# Altium schematic sheet [08] - Slave_Power.SchDoc: =ProjectName
size A4; CheckedBy: DatNB; Author: Ven; CompanyName: Nacentech; Organization: IMET
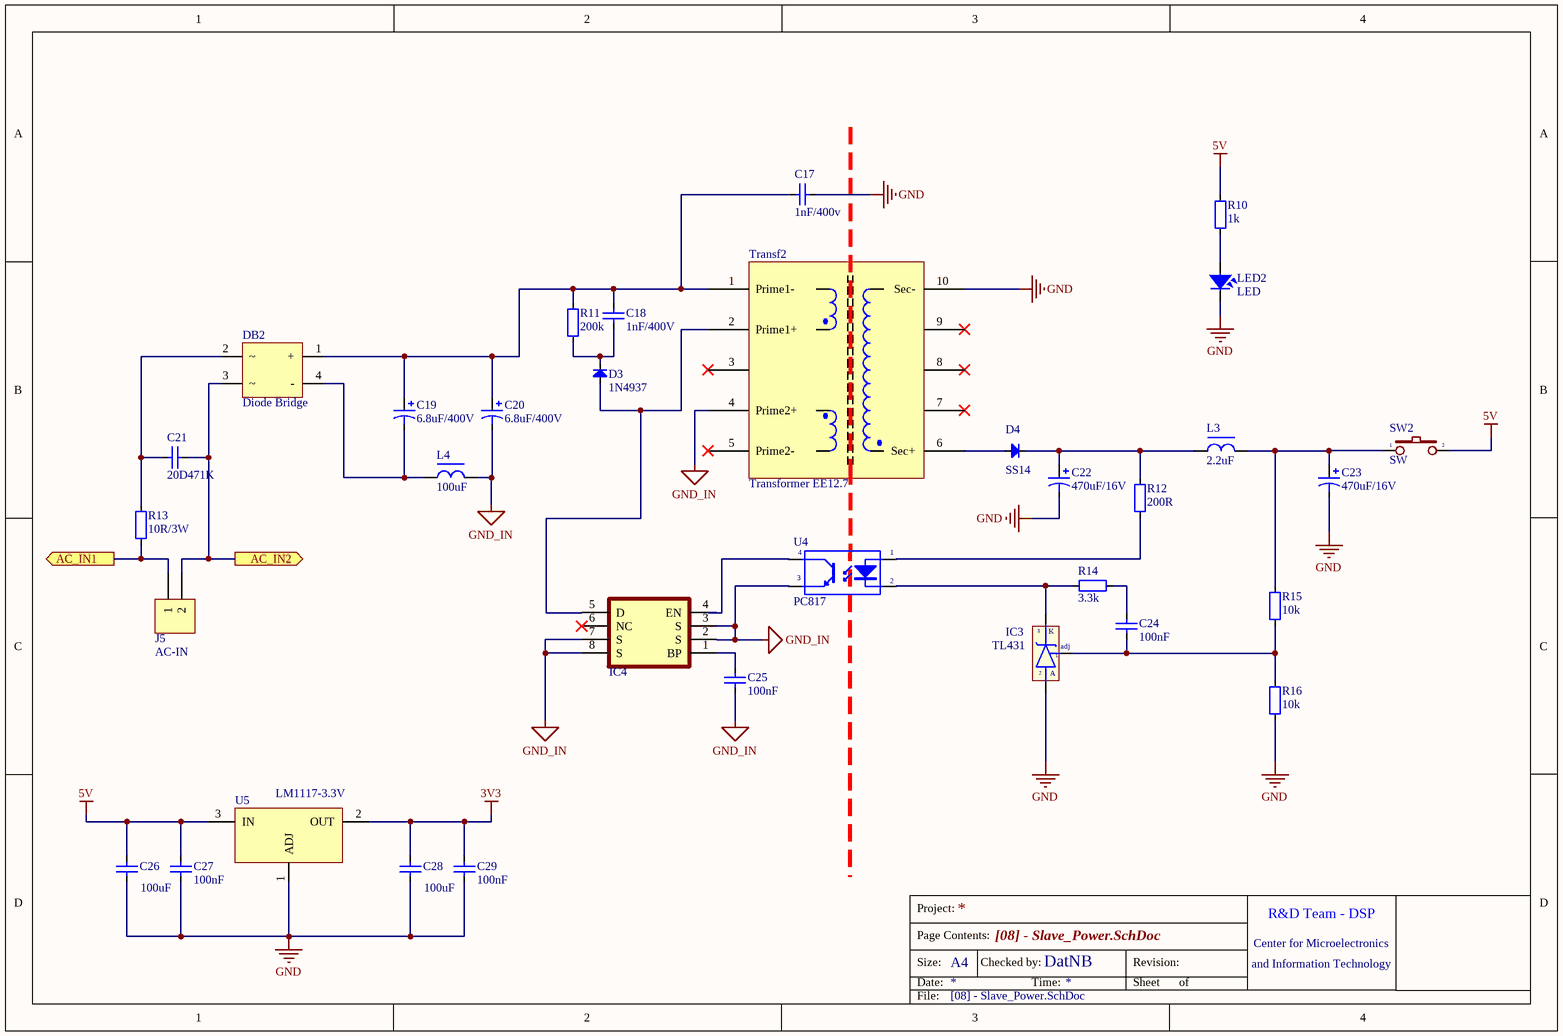
[diagram p0: [08] - Slave_Power.SchDoc]

## Parts
C17  1nF/400v  [103/2KV]
C18  1nF/400V  [103/2KV]
C19  6.8uF/400V  [C8mm]
C20  6.8uF/400V  [C8mm]
C21  20D471K  [103/2KV]
C22  470uF/16V  [C8mm]
C23  470uF/16V  [C8mm]
C24  100nF  [CAP_0805]
C25  100nF  [CAP_0805]
C26  100uF  [CAP_3216]
C27  100nF  [CAP_0805]
C28  100uF  [CAP_3216]
C29  100nF  [CAP_0805]
D3  1N4937  [DIO-1AN]
D4  SS14  [DO-214AC(SMA)]
DB2  Diode Bridge  [DB207S]
IC3  TL431  [qto-92]
IC4  TNY267  [DIP8]  (value not drawn)
J5  AC-IN  [KF2-5.08]
L3  2.2uF  [L-SMD-M-7.3x4.5]
L4  100uF  [L-DIP-M-9.5x6]
LED2  LED  [LED-0805-Red]
R10  1k  [RES-SMD-0805]
R11  200k  [RES-1/4WD]
R12  200R  [RES-SMD-0805]
R13  10R/3W  [RES-1WD]
R14  3.3k  [RES-SMD-0805]
R15  10k  [RES-SMD-0805]
R16  10k  [RES-SMD-0805]
SW2  SW  [SW2]
Transf2  Transformer EE12.7  [Transformer EE12.7]
U4  PC817  [DIP4/W0.3]
U5  LM1117-3.3V  [LM1117-SOP]

## Ports
AC_IN1 (out), AC_IN2 (out)

## Nets
3V3: C28.2 C29.2 U5.2(OUT)
5V: C26.2 C27.2 R10.2 SW2.2 U5.3(IN)
GND: C17.1 C22.2 C23.2 C26.1 C27.1 C28.1 C29.1 IC3.2(A) LED2.2 R16.2 Transf2.10(Sec-) U5.1(ADJ)
GND_IN: C20.2 C25.1 IC4.2(S) IC4.3(S) IC4.7(S) IC4.8(S) L4.2 Transf2.4(Prime2+) U4.3(E)
AC_IN1: J5.1 R13.2 ; port AC_IN1
AC_IN2: C21.1 DB2.3 J5.2 ; port AC_IN2
NetC17_2: C17.2 C18.1 C19.1 C20.1 DB2.1(+) R11.2 Transf2.1(Prime1-)
NetC18_2: C18.2 D3.2(K) R11.1
NetC19_2: C19.2 DB2.4(-) L4.1
NetC21_2: C21.2 DB2.2 R13.1
NetC22_1: C22.1 D4.2(K) L3.1 R12.1
NetC23_1: C23.1 L3.2 R15.1 SW2.1
NetC24_1: C24.1 IC3.1(adj) R15.2 R16.1
NetC24_2: C24.2 R14.2
NetC25_2: C25.2 IC4.1(BP)
NetD3_1: D3.1(A) IC4.5(D) Transf2.2(Prime1+)
NetD4_1: D4.1(A) Transf2.6(Sec+)
NetIC3_3: IC3.3(K) R14.1 U4.2(K)
NetIC4_4: IC4.4(EN) U4.4(C)
NetLED2_1: LED2.1 R10.1
NetR12_2: R12.2 U4.1(A)

Not connected (* = marked no-connect by the designer): IC4 6(NC)*; Transf2 3* 5(Prime2-)* 7* 8* 9*

## Notes on the sheet
- Project:
- R&D Team - DSP
- Page Contents:
- Size:
- Date:
- A4
- Checked by:
- Time:
- Revision:
- Sheet
- of
- Center for Microelectronics
- and Information Technology
- File:

## Library data of the parts
C17 C18 = Cap2KV: CAP CERAMIC; Published: 8-Jun-2000; LatestRevisionDate: 17-Jul-2002; LatestRevisionNote: Re-released for DXP Platform.; PackageReference: RAD-0.3; Publisher: Altium Limited
C19 C20 C22 C23 = Cap Pol: Polarized Capacitor (Axial); Published: 8-Jun-2000; LatestRevisionDate: 17-Jul-2002; LatestRevisionNote: Re-released for DXP Platform.; PackageReference: POLAR0.8; Publisher: Altium Limited
C21 = Cap2KV: Varistor; Published: 8-Jun-2000; LatestRevisionDate: 17-Jul-2002; LatestRevisionNote: Re-released for DXP Platform.; PackageReference: RAD-0.3; Publisher: Altium Limited
C24 C25 C27 C29 = CapSMD: Capacitor; Value: 33p; Published: 8-Jun-2000; LatestRevisionDate: 17-Jul-2002; LatestRevisionNote: Re-released for DXP Platform.; PackageReference: RAD-0.3; Publisher: Altium Limited
C26 C28 = CapSMD: Capacitor SMD; Value: 33p; Published: 8-Jun-2000; LatestRevisionDate: 17-Jul-2002; LatestRevisionNote: Re-released for DXP Platform.; PackageReference: RAD-0.3; Publisher: Altium Limited
D3 = Diode SMD: Diode Schottky / 1N4937; Code - JEDEC: DO-214-AB; Value: 1N5007; Published: 8-Jun-2000; Revision: July-2002: Re-released for DXP Platform.; Publisher: Altium Limited
D4 = Diode SMD: Diode Schottky / 1N5819; Code - JEDEC: DO-214-AB; Value: 1N5007; Published: 8-Jun-2000; Revision: July-2002: Re-released for DXP Platform.; Publisher: Altium Limited
DB2 = Diode Bridge Flate
IC3 = TL431: Programmable Shunt Regulator; Value: TL431
IC4 = TNY264: Enhanced, Energy Efficient, Low Power Off-line Switcher
J5 = KF2: Manufacturer: Würth Elektronik eiSos GmbH; partNo: 691103110002; ComponentLink1 Description: Manufacturer; ComponentLink2 Description: Datasheet; NoPins: 2; Created Date: 29 October 2013; ComponentLink1URL: http://www.we-online.com; ComponentLink2URL: http://katalog.we-online.de/em/datasheet/6911031100xx.pdf; Created by: Karrer Zheng
L3 L4 = L-DIP-1: Inductor; Value: 150 mH
LED2 = LED: LED Single colour Green and Red; Value: LED 3 ly Single Colour
R10-R16 = Resistor - SMD: Resistor; Manufacturer: Generic Components; Class: Passive; Published: 08/06/2000; Publisher: Altium Hobart Technology Centre
SW2 = SW2: Switch button 2 pin; Value: SW chip 2 pin
Transf2 = Tranformer EE16
U4 = PC817: Single Opto; Value: PC817
U5 = LM1117-ADJ: 800mA Low-Dropout Linear Regulator; Creator: Nguyen Ba Bien; Website: http://group3i.net